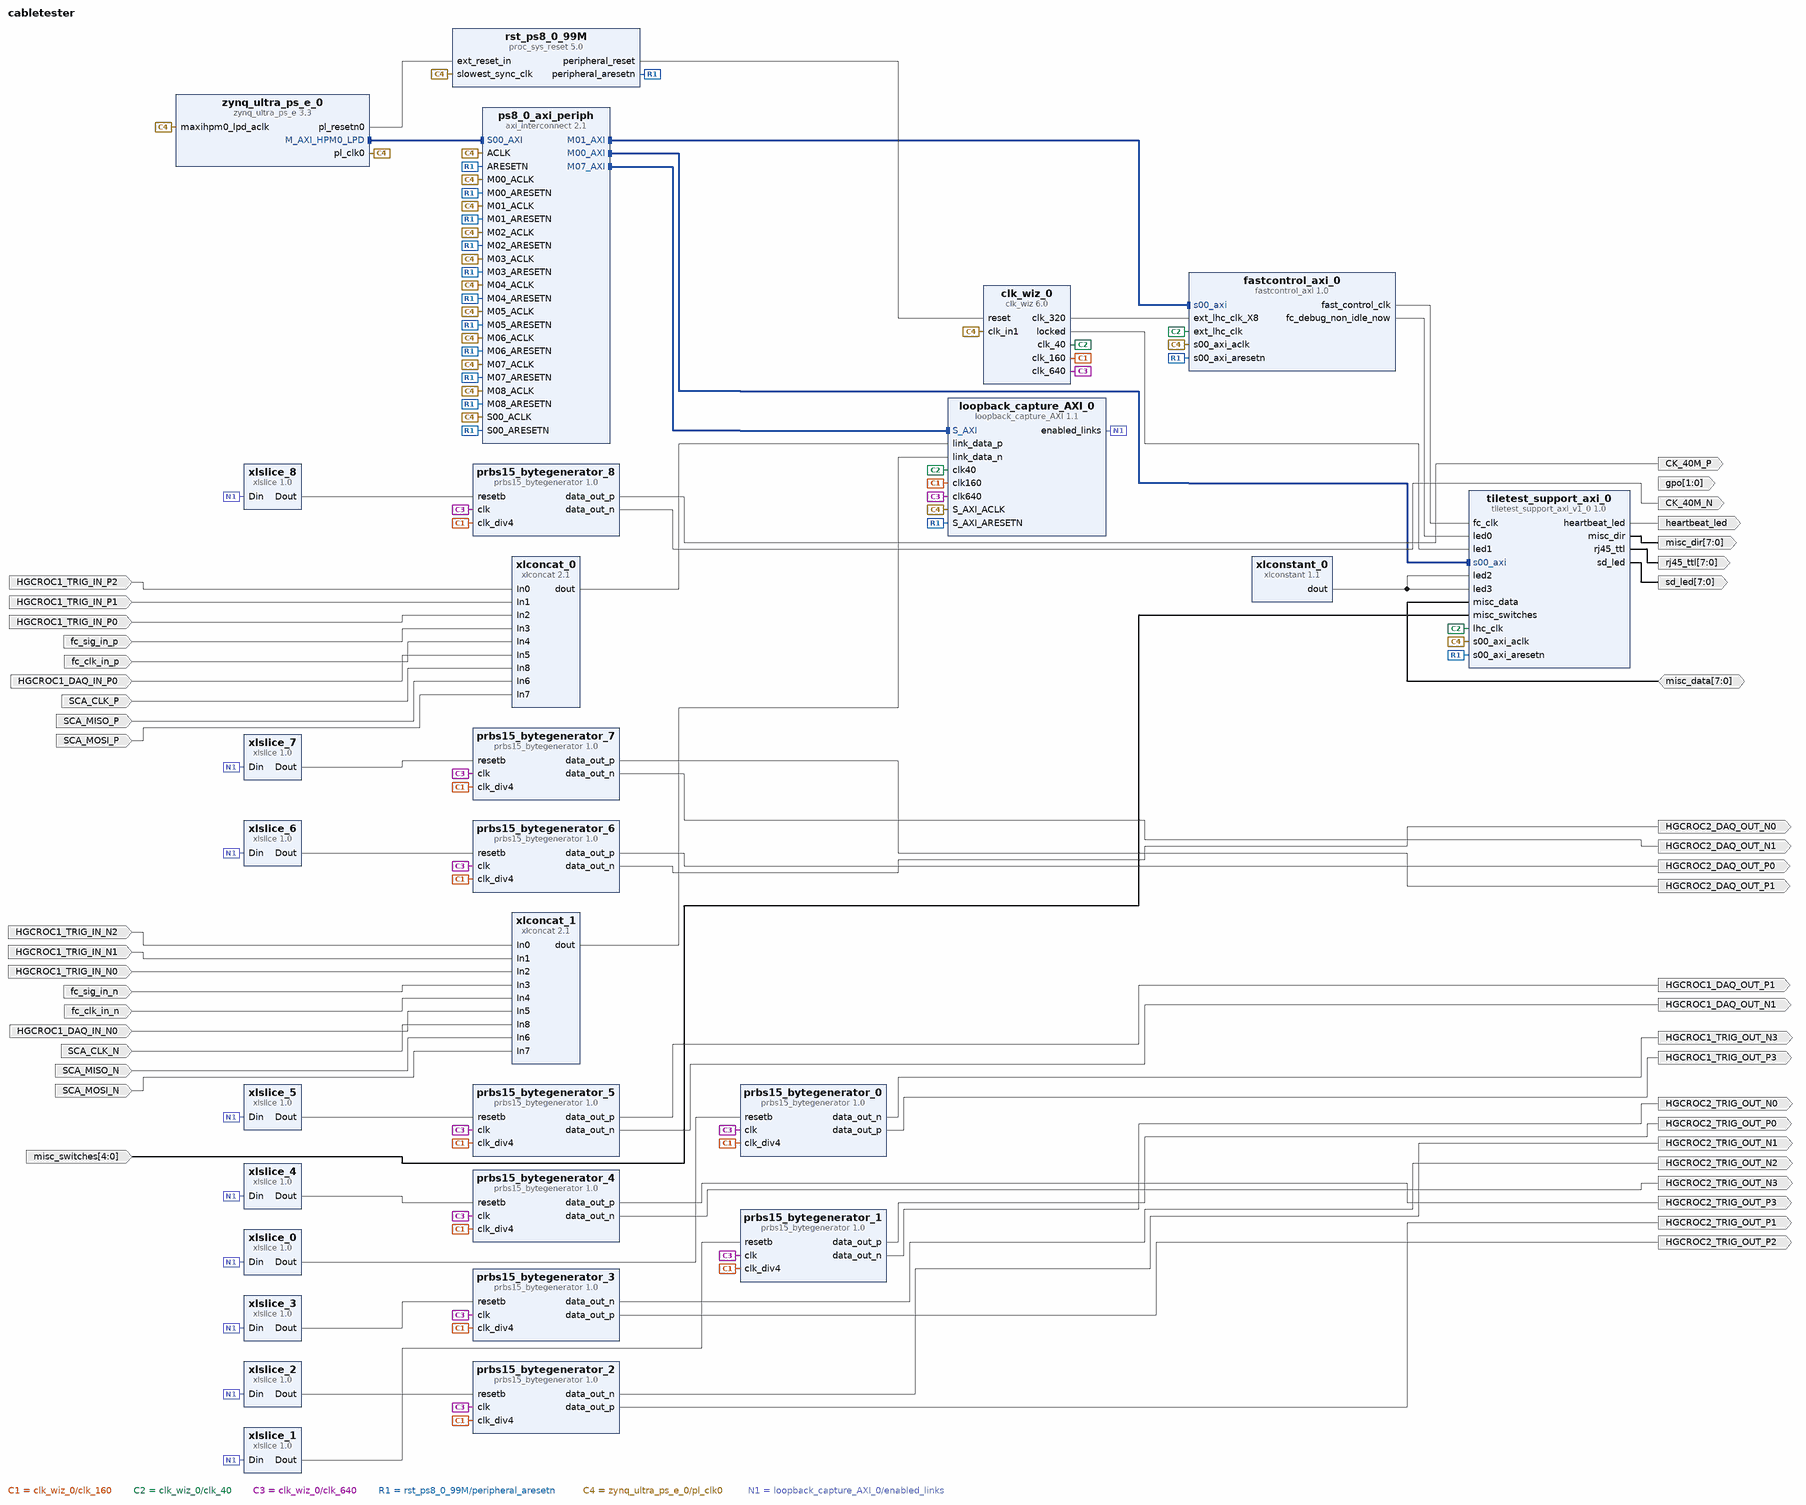
[diagram p0: block diagram of the top level]
# Vivado block design cabletester, xczu2cg-sfvc784-1-e, Vivado 2019.2
create_bd_design cabletester

create_bd_port -dir I HGCROC1_TRIG_IN_N2
create_bd_port -dir I HGCROC1_TRIG_IN_P2
create_bd_port -dir O HGCROC1_TRIG_OUT_N3
create_bd_port -dir O HGCROC1_TRIG_OUT_P3
create_bd_port -dir O -from 1 -to 0 gpo
create_bd_port -dir O heartbeat_led
create_bd_port -dir IO -from 7 -to 0 misc_data
create_bd_port -dir O -from 7 -to 0 misc_dir
create_bd_port -dir I -from 4 -to 0 misc_switches
create_bd_port -dir O -from 7 -to 0 rj45_ttl
create_bd_port -dir O -from 7 -to 0 sd_led
create_bd_port -dir O HGCROC2_TRIG_OUT_P1
create_bd_port -dir O HGCROC2_TRIG_OUT_P2
create_bd_port -dir O HGCROC2_TRIG_OUT_P3
create_bd_port -dir O HGCROC2_TRIG_OUT_P0
create_bd_port -dir O HGCROC2_TRIG_OUT_N2
create_bd_port -dir O HGCROC2_TRIG_OUT_N3
create_bd_port -dir O HGCROC2_TRIG_OUT_N0
create_bd_port -dir O HGCROC2_TRIG_OUT_N1
create_bd_port -dir O HGCROC1_DAQ_OUT_P1
create_bd_port -dir O HGCROC1_DAQ_OUT_N1
create_bd_port -dir O HGCROC2_DAQ_OUT_P0
create_bd_port -dir O HGCROC2_DAQ_OUT_P1
create_bd_port -dir O HGCROC2_DAQ_OUT_N0
create_bd_port -dir O HGCROC2_DAQ_OUT_N1
create_bd_port -dir O CK_40M_P
create_bd_port -dir O CK_40M_N
create_bd_port -dir I HGCROC1_TRIG_IN_P1
create_bd_port -dir I HGCROC1_TRIG_IN_N1
create_bd_port -dir I HGCROC1_TRIG_IN_P0
create_bd_port -dir I HGCROC1_TRIG_IN_N0
create_bd_port -dir I fc_sig_in_p
create_bd_port -dir I fc_sig_in_n
create_bd_port -dir I fc_clk_in_p
create_bd_port -dir I fc_clk_in_n
create_bd_port -dir I HGCROC1_DAQ_IN_P0
create_bd_port -dir I HGCROC1_DAQ_IN_N0
create_bd_port -dir I SCA_MOSI_P
create_bd_port -dir I SCA_MOSI_N
create_bd_port -dir I SCA_MISO_P
create_bd_port -dir I SCA_MISO_N
create_bd_port -dir I SCA_CLK_P
create_bd_port -dir I SCA_CLK_N

create_bd_cell -type ip -vlnv xilinx.com:user:fastcontrol_axi:1.0 fastcontrol_axi_0
create_bd_cell -type ip -vlnv xilinx.com:ip:proc_sys_reset:5.0 rst_ps8_0_99M
create_bd_cell -type ip -vlnv xilinx.com:user:tiletest_support_axi_v1_0:1.0 tiletest_support_axi_0
create_bd_cell -type ip -vlnv user.org:user:prbs15_bytegenerator:1.0 prbs15_bytegenerator_0
create_bd_cell -type ip -vlnv user.org:user:prbs15_bytegenerator:1.0 prbs15_bytegenerator_1
create_bd_cell -type ip -vlnv user.org:user:prbs15_bytegenerator:1.0 prbs15_bytegenerator_2
create_bd_cell -type ip -vlnv user.org:user:prbs15_bytegenerator:1.0 prbs15_bytegenerator_3
create_bd_cell -type ip -vlnv user.org:user:prbs15_bytegenerator:1.0 prbs15_bytegenerator_4
create_bd_cell -type ip -vlnv user.org:user:prbs15_bytegenerator:1.0 prbs15_bytegenerator_5
create_bd_cell -type ip -vlnv user.org:user:prbs15_bytegenerator:1.0 prbs15_bytegenerator_6
create_bd_cell -type ip -vlnv user.org:user:prbs15_bytegenerator:1.0 prbs15_bytegenerator_7
create_bd_cell -type ip -vlnv user.org:user:prbs15_bytegenerator:1.0 prbs15_bytegenerator_8
create_bd_cell -type ip -vlnv user.org:user:loopback_capture_AXI:1.1 loopback_capture_AXI_0
create_bd_cell -type ip -vlnv xilinx.com:ip:clk_wiz:6.0 clk_wiz_0
set_property -dict [list \
  CONFIG.CLKOUT1_JITTER 161.073 \
  CONFIG.CLKOUT1_PHASE_ERROR 320.727 \
  CONFIG.CLKOUT1_REQUESTED_OUT_FREQ 320 \
  CONFIG.CLKOUT2_JITTER 212.577 \
  CONFIG.CLKOUT2_PHASE_ERROR 320.727 \
  CONFIG.CLKOUT2_REQUESTED_OUT_FREQ 40 \
  CONFIG.CLKOUT2_USED true \
  CONFIG.CLKOUT3_JITTER 193.445 \
  CONFIG.CLKOUT3_PHASE_ERROR 320.727 \
  CONFIG.CLKOUT3_REQUESTED_OUT_FREQ 80 \
  CONFIG.CLKOUT3_USED true \
  CONFIG.CLKOUT4_JITTER 176.430 \
  CONFIG.CLKOUT4_PHASE_ERROR 320.727 \
  CONFIG.CLKOUT4_REQUESTED_OUT_FREQ 160 \
  CONFIG.CLKOUT4_USED true \
  CONFIG.CLKOUT5_JITTER 147.227 \
  CONFIG.CLKOUT5_PHASE_ERROR 320.727 \
  CONFIG.CLKOUT5_REQUESTED_OUT_FREQ 640 \
  CONFIG.CLKOUT5_USED true \
  CONFIG.CLK_OUT1_PORT clk_320 \
  CONFIG.CLK_OUT2_PORT clk_40 \
  CONFIG.CLK_OUT3_PORT clk_80 \
  CONFIG.CLK_OUT4_PORT clk_160 \
  CONFIG.CLK_OUT5_PORT clk_640 \
  CONFIG.MMCM_CLKFBOUT_MULT_F 64.000 \
  CONFIG.MMCM_CLKIN1_PERIOD 10.000 \
  CONFIG.MMCM_CLKIN2_PERIOD 10.000 \
  CONFIG.MMCM_CLKOUT0_DIVIDE_F 4.000 \
  CONFIG.MMCM_CLKOUT1_DIVIDE 32 \
  CONFIG.MMCM_CLKOUT2_DIVIDE 16 \
  CONFIG.MMCM_CLKOUT3_DIVIDE 8 \
  CONFIG.MMCM_CLKOUT4_DIVIDE 2 \
  CONFIG.MMCM_DIVCLK_DIVIDE 5 \
  CONFIG.NUM_OUT_CLKS 5 \
] [get_bd_cells clk_wiz_0]
create_bd_cell -type ip -vlnv xilinx.com:ip:axi_interconnect:2.1 ps8_0_axi_periph
set_property -dict {CONFIG.NUM_MI 9} [get_bd_cells ps8_0_axi_periph]
create_bd_cell -type ip -vlnv xilinx.com:ip:xlconcat:2.1 xlconcat_0
set_property -dict {CONFIG.NUM_PORTS 9 CONFIG.dout_width 9} [get_bd_cells xlconcat_0]
create_bd_cell -type ip -vlnv xilinx.com:ip:xlconcat:2.1 xlconcat_1
set_property -dict {CONFIG.NUM_PORTS 9 CONFIG.dout_width 9} [get_bd_cells xlconcat_1]
create_bd_cell -type ip -vlnv xilinx.com:ip:xlconstant:1.1 xlconstant_0
set_property -dict {CONFIG.CONST_VAL 0} [get_bd_cells xlconstant_0]
create_bd_cell -type ip -vlnv xilinx.com:ip:xlslice:1.0 xlslice_0
set_property -dict {CONFIG.DIN_FROM 0 CONFIG.DIN_TO 0 CONFIG.DIN_WIDTH 9 CONFIG.DOUT_WIDTH 1} [get_bd_cells xlslice_0]
create_bd_cell -type ip -vlnv xilinx.com:ip:xlslice:1.0 xlslice_1
set_property -dict {CONFIG.DIN_FROM 1 CONFIG.DIN_TO 1 CONFIG.DIN_WIDTH 9 CONFIG.DOUT_WIDTH 1} [get_bd_cells xlslice_1]
create_bd_cell -type ip -vlnv xilinx.com:ip:xlslice:1.0 xlslice_2
set_property -dict {CONFIG.DIN_FROM 2 CONFIG.DIN_TO 2 CONFIG.DIN_WIDTH 9 CONFIG.DOUT_WIDTH 1} [get_bd_cells xlslice_2]
create_bd_cell -type ip -vlnv xilinx.com:ip:xlslice:1.0 xlslice_3
set_property -dict {CONFIG.DIN_FROM 3 CONFIG.DIN_TO 3 CONFIG.DIN_WIDTH 9 CONFIG.DOUT_WIDTH 1} [get_bd_cells xlslice_3]
create_bd_cell -type ip -vlnv xilinx.com:ip:xlslice:1.0 xlslice_4
set_property -dict {CONFIG.DIN_FROM 4 CONFIG.DIN_TO 4 CONFIG.DIN_WIDTH 9 CONFIG.DOUT_WIDTH 1} [get_bd_cells xlslice_4]
create_bd_cell -type ip -vlnv xilinx.com:ip:xlslice:1.0 xlslice_5
set_property -dict {CONFIG.DIN_FROM 5 CONFIG.DIN_TO 5 CONFIG.DIN_WIDTH 9 CONFIG.DOUT_WIDTH 1} [get_bd_cells xlslice_5]
create_bd_cell -type ip -vlnv xilinx.com:ip:xlslice:1.0 xlslice_6
set_property -dict {CONFIG.DIN_FROM 6 CONFIG.DIN_TO 6 CONFIG.DIN_WIDTH 9 CONFIG.DOUT_WIDTH 1} [get_bd_cells xlslice_6]
create_bd_cell -type ip -vlnv xilinx.com:ip:xlslice:1.0 xlslice_7
set_property -dict {CONFIG.DIN_FROM 7 CONFIG.DIN_TO 7 CONFIG.DIN_WIDTH 9 CONFIG.DOUT_WIDTH 1} [get_bd_cells xlslice_7]
create_bd_cell -type ip -vlnv xilinx.com:ip:xlslice:1.0 xlslice_8
set_property -dict {CONFIG.DIN_FROM 8 CONFIG.DIN_TO 8 CONFIG.DIN_WIDTH 9 CONFIG.DOUT_WIDTH 1} [get_bd_cells xlslice_8]
create_bd_cell -type ip -vlnv xilinx.com:ip:zynq_ultra_ps_e:3.3 zynq_ultra_ps_e_0
set_property -dict [list \
  CONFIG.CAN0_BOARD_INTERFACE custom \
  CONFIG.CAN1_BOARD_INTERFACE custom \
  CONFIG.CSU_BOARD_INTERFACE custom \
  CONFIG.DP_BOARD_INTERFACE custom \
  CONFIG.GEM0_BOARD_INTERFACE custom \
  CONFIG.GEM1_BOARD_INTERFACE custom \
  CONFIG.GEM2_BOARD_INTERFACE custom \
  CONFIG.GEM3_BOARD_INTERFACE custom \
  CONFIG.GPIO_BOARD_INTERFACE custom \
  CONFIG.IIC0_BOARD_INTERFACE custom \
  CONFIG.IIC1_BOARD_INTERFACE custom \
  CONFIG.NAND_BOARD_INTERFACE custom \
  CONFIG.PCIE_BOARD_INTERFACE custom \
  CONFIG.PJTAG_BOARD_INTERFACE custom \
  CONFIG.PMU_BOARD_INTERFACE custom \
  CONFIG.PSU_BANK_0_IO_STANDARD LVCMOS18 \
  CONFIG.PSU_BANK_1_IO_STANDARD LVCMOS33 \
  CONFIG.PSU_BANK_2_IO_STANDARD LVCMOS18 \
  CONFIG.PSU_BANK_3_IO_STANDARD LVCMOS18 \
  CONFIG.PSU_USB3__DUAL_CLOCK_ENABLE 1 \
  CONFIG.PSU__ACPU2__POWER__ON 0 \
  CONFIG.PSU__ACPU3__POWER__ON 0 \
  CONFIG.PSU__CAN1__PERIPHERAL__ENABLE 0 \
  CONFIG.PSU__CRF_APB__ACPU_CTRL__FREQMHZ 1200 \
  CONFIG.PSU__CRF_APB__ACPU_CTRL__SRCSEL APLL \
  CONFIG.PSU__CRF_APB__APLL_CTRL__SRCSEL PSS_REF_CLK \
  CONFIG.PSU__CRF_APB__DBG_FPD_CTRL__FREQMHZ 250 \
  CONFIG.PSU__CRF_APB__DBG_FPD_CTRL__SRCSEL IOPLL \
  CONFIG.PSU__CRF_APB__DBG_TRACE_CTRL__FREQMHZ 250 \
  CONFIG.PSU__CRF_APB__DBG_TRACE_CTRL__SRCSEL IOPLL \
  CONFIG.PSU__CRF_APB__DBG_TSTMP_CTRL__FREQMHZ 250 \
  CONFIG.PSU__CRF_APB__DBG_TSTMP_CTRL__SRCSEL IOPLL \
  CONFIG.PSU__CRF_APB__DDR_CTRL__FREQMHZ 1200 \
  CONFIG.PSU__CRF_APB__DDR_CTRL__SRCSEL DPLL \
  CONFIG.PSU__CRF_APB__DPDMA_REF_CTRL__FREQMHZ 600 \
  CONFIG.PSU__CRF_APB__DPDMA_REF_CTRL__SRCSEL DPLL \
  CONFIG.PSU__CRF_APB__DPLL_CTRL__SRCSEL PSS_REF_CLK \
  CONFIG.PSU__CRF_APB__DP_AUDIO_REF_CTRL__SRCSEL VPLL \
  CONFIG.PSU__CRF_APB__DP_STC_REF_CTRL__SRCSEL VPLL \
  CONFIG.PSU__CRF_APB__DP_VIDEO_REF_CTRL__SRCSEL DPLL \
  CONFIG.PSU__CRF_APB__GDMA_REF_CTRL__FREQMHZ 600 \
  CONFIG.PSU__CRF_APB__GDMA_REF_CTRL__SRCSEL DPLL \
  CONFIG.PSU__CRF_APB__GPU_REF_CTRL__FREQMHZ 600 \
  CONFIG.PSU__CRF_APB__GPU_REF_CTRL__SRCSEL DPLL \
  CONFIG.PSU__CRF_APB__TOPSW_LSBUS_CTRL__FREQMHZ 100 \
  CONFIG.PSU__CRF_APB__TOPSW_LSBUS_CTRL__SRCSEL IOPLL \
  CONFIG.PSU__CRF_APB__TOPSW_MAIN_CTRL__FREQMHZ 533.333 \
  CONFIG.PSU__CRF_APB__TOPSW_MAIN_CTRL__SRCSEL VPLL \
  CONFIG.PSU__CRF_APB__VPLL_CTRL__SRCSEL PSS_REF_CLK \
  CONFIG.PSU__CRL_APB__ADMA_REF_CTRL__FREQMHZ 500 \
  CONFIG.PSU__CRL_APB__ADMA_REF_CTRL__SRCSEL IOPLL \
  CONFIG.PSU__CRL_APB__CAN1_REF_CTRL__FREQMHZ 100 \
  CONFIG.PSU__CRL_APB__CAN1_REF_CTRL__SRCSEL IOPLL \
  CONFIG.PSU__CRL_APB__CPU_R5_CTRL__FREQMHZ 500 \
  CONFIG.PSU__CRL_APB__CPU_R5_CTRL__SRCSEL IOPLL \
  CONFIG.PSU__CRL_APB__DBG_LPD_CTRL__FREQMHZ 250 \
  CONFIG.PSU__CRL_APB__DBG_LPD_CTRL__SRCSEL IOPLL \
  CONFIG.PSU__CRL_APB__GEM3_REF_CTRL__FREQMHZ 125 \
  CONFIG.PSU__CRL_APB__GEM3_REF_CTRL__SRCSEL IOPLL \
  CONFIG.PSU__CRL_APB__I2C0_REF_CTRL__FREQMHZ 100 \
  CONFIG.PSU__CRL_APB__I2C0_REF_CTRL__SRCSEL IOPLL \
  CONFIG.PSU__CRL_APB__I2C1_REF_CTRL__FREQMHZ 100 \
  CONFIG.PSU__CRL_APB__I2C1_REF_CTRL__SRCSEL IOPLL \
  CONFIG.PSU__CRL_APB__IOPLL_CTRL__SRCSEL PSS_REF_CLK \
  CONFIG.PSU__CRL_APB__IOU_SWITCH_CTRL__FREQMHZ 267 \
  CONFIG.PSU__CRL_APB__IOU_SWITCH_CTRL__SRCSEL RPLL \
  CONFIG.PSU__CRL_APB__LPD_LSBUS_CTRL__FREQMHZ 100 \
  CONFIG.PSU__CRL_APB__LPD_LSBUS_CTRL__SRCSEL IOPLL \
  CONFIG.PSU__CRL_APB__LPD_SWITCH_CTRL__FREQMHZ 500 \
  CONFIG.PSU__CRL_APB__LPD_SWITCH_CTRL__SRCSEL IOPLL \
  CONFIG.PSU__CRL_APB__PCAP_CTRL__FREQMHZ 200 \
  CONFIG.PSU__CRL_APB__PCAP_CTRL__SRCSEL IOPLL \
  CONFIG.PSU__CRL_APB__PL0_REF_CTRL__FREQMHZ 100 \
  CONFIG.PSU__CRL_APB__PL0_REF_CTRL__SRCSEL RPLL \
  CONFIG.PSU__CRL_APB__QSPI_REF_CTRL__FREQMHZ 300 \
  CONFIG.PSU__CRL_APB__QSPI_REF_CTRL__SRCSEL IOPLL \
  CONFIG.PSU__CRL_APB__RPLL_CTRL__SRCSEL PSS_REF_CLK \
  CONFIG.PSU__CRL_APB__SDIO1_REF_CTRL__FREQMHZ 200 \
  CONFIG.PSU__CRL_APB__SDIO1_REF_CTRL__SRCSEL RPLL \
  CONFIG.PSU__CRL_APB__TIMESTAMP_REF_CTRL__FREQMHZ 100 \
  CONFIG.PSU__CRL_APB__TIMESTAMP_REF_CTRL__SRCSEL PSS_REF_CLK \
  CONFIG.PSU__CRL_APB__UART0_REF_CTRL__FREQMHZ 100 \
  CONFIG.PSU__CRL_APB__UART0_REF_CTRL__SRCSEL IOPLL \
  CONFIG.PSU__CRL_APB__UART1_REF_CTRL__FREQMHZ 100 \
  CONFIG.PSU__CRL_APB__UART1_REF_CTRL__SRCSEL IOPLL \
  CONFIG.PSU__CRL_APB__USB0_BUS_REF_CTRL__FREQMHZ 250 \
  CONFIG.PSU__CRL_APB__USB0_BUS_REF_CTRL__SRCSEL IOPLL \
  CONFIG.PSU__CRL_APB__USB3_DUAL_REF_CTRL__FREQMHZ 20 \
  CONFIG.PSU__CRL_APB__USB3_DUAL_REF_CTRL__SRCSEL IOPLL \
  CONFIG.PSU__CRL_APB__USB3__ENABLE 1 \
  CONFIG.PSU__CSUPMU__PERIPHERAL__VALID 0 \
  CONFIG.PSU__DDRC__BUS_WIDTH {32 Bit} \
  CONFIG.PSU__DDRC__COMPONENTS Components \
  CONFIG.PSU__DDRC__DEVICE_CAPACITY {8192 MBits} \
  CONFIG.PSU__DDRC__DRAM_WIDTH {16 Bits} \
  CONFIG.PSU__DDRC__ECC Disabled \
  CONFIG.PSU__DDRC__MEMORY_TYPE {DDR 4} \
  CONFIG.PSU__DDRC__SPEED_BIN DDR4_2400P \
  CONFIG.PSU__DDR_HIGH_ADDRESS_GUI_ENABLE 0 \
  CONFIG.PSU__DDR__INTERFACE__FREQMHZ 600.000 \
  CONFIG.PSU__DEVICE_TYPE CG \
  CONFIG.PSU__DISPLAYPORT__PERIPHERAL__ENABLE 0 \
  CONFIG.PSU__DLL__ISUSED 1 \
  CONFIG.PSU__ENET3__FIFO__ENABLE 0 \
  CONFIG.PSU__ENET3__GRP_MDIO__ENABLE 1 \
  CONFIG.PSU__ENET3__GRP_MDIO__IO {MIO 76 .. 77} \
  CONFIG.PSU__ENET3__PERIPHERAL__ENABLE 1 \
  CONFIG.PSU__ENET3__PERIPHERAL__IO {MIO 64 .. 75} \
  CONFIG.PSU__ENET3__PTP__ENABLE 0 \
  CONFIG.PSU__ENET3__TSU__ENABLE 0 \
  CONFIG.PSU__FPGA_PL0_ENABLE 1 \
  CONFIG.PSU__GEM3_COHERENCY 0 \
  CONFIG.PSU__GEM3_ROUTE_THROUGH_FPD 0 \
  CONFIG.PSU__GEM__TSU__ENABLE 0 \
  CONFIG.PSU__GPIO0_MIO__IO {MIO 0 .. 25} \
  CONFIG.PSU__GPIO0_MIO__PERIPHERAL__ENABLE 1 \
  CONFIG.PSU__GPIO1_MIO__PERIPHERAL__ENABLE 0 \
  CONFIG.PSU__GPU_PP0__POWER__ON 0 \
  CONFIG.PSU__GPU_PP1__POWER__ON 0 \
  CONFIG.PSU__I2C0__PERIPHERAL__ENABLE 1 \
  CONFIG.PSU__I2C0__PERIPHERAL__IO {MIO 38 .. 39} \
  CONFIG.PSU__I2C1__PERIPHERAL__ENABLE 0 \
  CONFIG.PSU__IOU_SLCR__IOU_TTC_APB_CLK__TTC0_SEL APB \
  CONFIG.PSU__IOU_SLCR__IOU_TTC_APB_CLK__TTC1_SEL APB \
  CONFIG.PSU__IOU_SLCR__IOU_TTC_APB_CLK__TTC2_SEL APB \
  CONFIG.PSU__IOU_SLCR__IOU_TTC_APB_CLK__TTC3_SEL APB \
  CONFIG.PSU__LPD_SLCR__CSUPMU__FREQMHZ 100 \
  CONFIG.PSU__OVERRIDE__BASIC_CLOCK 0 \
  CONFIG.PSU__PMU__PERIPHERAL__ENABLE 0 \
  CONFIG.PSU__PRESET_APPLIED 1 \
  CONFIG.PSU__PSS_REF_CLK__FREQMHZ 33.33333 \
  CONFIG.PSU__QSPI_COHERENCY 0 \
  CONFIG.PSU__QSPI_ROUTE_THROUGH_FPD 0 \
  CONFIG.PSU__QSPI__GRP_FBCLK__ENABLE 1 \
  CONFIG.PSU__QSPI__GRP_FBCLK__IO {MIO 6} \
  CONFIG.PSU__QSPI__PERIPHERAL__DATA_MODE x4 \
  CONFIG.PSU__QSPI__PERIPHERAL__ENABLE 1 \
  CONFIG.PSU__QSPI__PERIPHERAL__IO {MIO 0 .. 12} \
  CONFIG.PSU__QSPI__PERIPHERAL__MODE {Dual Parallel} \
  CONFIG.PSU__SATA__PERIPHERAL__ENABLE 0 \
  CONFIG.PSU__SD0__DATA_TRANSFER_MODE 8Bit \
  CONFIG.PSU__SD0__GRP_POW__ENABLE 1 \
  CONFIG.PSU__SD0__GRP_POW__IO {MIO 23} \
  CONFIG.PSU__SD0__PERIPHERAL__ENABLE 1 \
  CONFIG.PSU__SD0__PERIPHERAL__IO {MIO 13 .. 22} \
  CONFIG.PSU__SD0__RESET__ENABLE 1 \
  CONFIG.PSU__SD0__SLOT_TYPE eMMC \
  CONFIG.PSU__SD1_COHERENCY 0 \
  CONFIG.PSU__SD1_ROUTE_THROUGH_FPD 0 \
  CONFIG.PSU__SD1__DATA_TRANSFER_MODE 4Bit \
  CONFIG.PSU__SD1__GRP_CD__ENABLE 0 \
  CONFIG.PSU__SD1__GRP_POW__ENABLE 0 \
  CONFIG.PSU__SD1__GRP_WP__ENABLE 0 \
  CONFIG.PSU__SD1__PERIPHERAL__ENABLE 1 \
  CONFIG.PSU__SD1__PERIPHERAL__IO {MIO 46 .. 51} \
  CONFIG.PSU__SD1__SLOT_TYPE {SD 2.0} \
  CONFIG.PSU__SWDT0__CLOCK__ENABLE 0 \
  CONFIG.PSU__SWDT0__PERIPHERAL__ENABLE 1 \
  CONFIG.PSU__SWDT0__RESET__ENABLE 0 \
  CONFIG.PSU__SWDT1__CLOCK__ENABLE 0 \
  CONFIG.PSU__SWDT1__PERIPHERAL__ENABLE 1 \
  CONFIG.PSU__SWDT1__RESET__ENABLE 0 \
  CONFIG.PSU__TSU__BUFG_PORT_PAIR 0 \
  CONFIG.PSU__TTC0__CLOCK__ENABLE 0 \
  CONFIG.PSU__TTC0__PERIPHERAL__ENABLE 1 \
  CONFIG.PSU__TTC0__WAVEOUT__ENABLE 0 \
  CONFIG.PSU__TTC1__CLOCK__ENABLE 0 \
  CONFIG.PSU__TTC1__PERIPHERAL__ENABLE 1 \
  CONFIG.PSU__TTC1__WAVEOUT__ENABLE 0 \
  CONFIG.PSU__TTC2__CLOCK__ENABLE 0 \
  CONFIG.PSU__TTC2__PERIPHERAL__ENABLE 1 \
  CONFIG.PSU__TTC2__WAVEOUT__ENABLE 0 \
  CONFIG.PSU__TTC3__CLOCK__ENABLE 0 \
  CONFIG.PSU__TTC3__PERIPHERAL__ENABLE 1 \
  CONFIG.PSU__TTC3__WAVEOUT__ENABLE 0 \
  CONFIG.PSU__UART0__BAUD_RATE 115200 \
  CONFIG.PSU__UART0__MODEM__ENABLE 0 \
  CONFIG.PSU__UART0__PERIPHERAL__ENABLE 1 \
  CONFIG.PSU__UART0__PERIPHERAL__IO {MIO 30 .. 31} \
  CONFIG.PSU__UART1__PERIPHERAL__ENABLE 0 \
  CONFIG.PSU__USB0_COHERENCY 0 \
  CONFIG.PSU__USB0__PERIPHERAL__ENABLE 1 \
  CONFIG.PSU__USB0__PERIPHERAL__IO {MIO 52 .. 63} \
  CONFIG.PSU__USB0__REF_CLK_FREQ 100 \
  CONFIG.PSU__USB0__REF_CLK_SEL {Ref Clk3} \
  CONFIG.PSU__USB2_0__EMIO__ENABLE 0 \
  CONFIG.PSU__USB3_0__EMIO__ENABLE 0 \
  CONFIG.PSU__USB3_0__PERIPHERAL__ENABLE 1 \
  CONFIG.PSU__USB3_0__PERIPHERAL__IO {GT Lane0} \
  CONFIG.PSU__USB__RESET__MODE {Boot Pin} \
  CONFIG.PSU__USB__RESET__POLARITY {Active Low} \
  CONFIG.PSU__USE__IRQ0 0 \
  CONFIG.PSU__USE__M_AXI_GP0 0 \
  CONFIG.PSU__USE__M_AXI_GP1 0 \
  CONFIG.PSU__USE__M_AXI_GP2 1 \
  CONFIG.QSPI_BOARD_INTERFACE custom \
  CONFIG.SATA_BOARD_INTERFACE custom \
  CONFIG.SD0_BOARD_INTERFACE custom \
  CONFIG.SD1_BOARD_INTERFACE custom \
  CONFIG.SPI0_BOARD_INTERFACE custom \
  CONFIG.SPI1_BOARD_INTERFACE custom \
  CONFIG.SUBPRESET1 Custom \
  CONFIG.SUBPRESET2 Custom \
  CONFIG.SWDT0_BOARD_INTERFACE custom \
  CONFIG.SWDT1_BOARD_INTERFACE custom \
  CONFIG.TRACE_BOARD_INTERFACE custom \
  CONFIG.TTC0_BOARD_INTERFACE custom \
  CONFIG.TTC1_BOARD_INTERFACE custom \
  CONFIG.TTC2_BOARD_INTERFACE custom \
  CONFIG.TTC3_BOARD_INTERFACE custom \
  CONFIG.UART0_BOARD_INTERFACE custom \
  CONFIG.UART1_BOARD_INTERFACE custom \
  CONFIG.USB0_BOARD_INTERFACE custom \
  CONFIG.USB1_BOARD_INTERFACE custom \
] [get_bd_cells zynq_ultra_ps_e_0]
# 726 more settings of zynq_ultra_ps_e_0 are not shown: defaults, MIO pin electricals, DDR timing, and values the tool derives

# ---- connections ----

connect_bd_intf_net [get_bd_intf_pins ps8_0_axi_periph/M00_AXI] [get_bd_intf_pins tiletest_support_axi_0/s00_axi]
connect_bd_intf_net [get_bd_intf_pins ps8_0_axi_periph/M07_AXI] [get_bd_intf_pins loopback_capture_AXI_0/S_AXI]
connect_bd_intf_net [get_bd_intf_pins ps8_0_axi_periph/M01_AXI] [get_bd_intf_pins fastcontrol_axi_0/s00_axi]
connect_bd_intf_net [get_bd_intf_pins zynq_ultra_ps_e_0/M_AXI_HPM0_LPD] [get_bd_intf_pins ps8_0_axi_periph/S00_AXI]
connect_bd_net [get_bd_ports misc_data] [get_bd_pins tiletest_support_axi_0/misc_data]
connect_bd_net [get_bd_pins clk_wiz_0/clk_160] \
  [get_bd_pins prbs15_bytegenerator_0/clk_div4] [get_bd_pins prbs15_bytegenerator_1/clk_div4] \
  [get_bd_pins prbs15_bytegenerator_2/clk_div4] [get_bd_pins prbs15_bytegenerator_3/clk_div4] \
  [get_bd_pins prbs15_bytegenerator_4/clk_div4] [get_bd_pins prbs15_bytegenerator_5/clk_div4] \
  [get_bd_pins prbs15_bytegenerator_6/clk_div4] [get_bd_pins prbs15_bytegenerator_7/clk_div4] \
  [get_bd_pins prbs15_bytegenerator_8/clk_div4] [get_bd_pins loopback_capture_AXI_0/clk160]
connect_bd_net [get_bd_pins clk_wiz_0/clk_320] [get_bd_pins fastcontrol_axi_0/ext_lhc_clk_X8]
connect_bd_net [get_bd_pins clk_wiz_0/clk_40] \
  [get_bd_pins fastcontrol_axi_0/ext_lhc_clk] [get_bd_pins tiletest_support_axi_0/lhc_clk] \
  [get_bd_pins loopback_capture_AXI_0/clk40]
connect_bd_net [get_bd_pins clk_wiz_0/clk_640] \
  [get_bd_pins prbs15_bytegenerator_0/clk] [get_bd_pins prbs15_bytegenerator_1/clk] [get_bd_pins prbs15_bytegenerator_2/clk] \
  [get_bd_pins prbs15_bytegenerator_3/clk] [get_bd_pins prbs15_bytegenerator_4/clk] [get_bd_pins prbs15_bytegenerator_5/clk] \
  [get_bd_pins prbs15_bytegenerator_6/clk] [get_bd_pins prbs15_bytegenerator_7/clk] [get_bd_pins prbs15_bytegenerator_8/clk] \
  [get_bd_pins loopback_capture_AXI_0/clk640]
connect_bd_net [get_bd_pins clk_wiz_0/locked] [get_bd_pins tiletest_support_axi_0/led1]
connect_bd_net [get_bd_pins fastcontrol_axi_0/fast_control_clk] [get_bd_pins tiletest_support_axi_0/fc_clk]
connect_bd_net [get_bd_pins fastcontrol_axi_0/fc_debug_non_idle_now] [get_bd_pins tiletest_support_axi_0/led0]
connect_bd_net [get_bd_ports misc_switches] [get_bd_pins tiletest_support_axi_0/misc_switches]
connect_bd_net [get_bd_pins prbs15_bytegenerator_0/data_out_n] [get_bd_ports HGCROC1_TRIG_OUT_N3]
connect_bd_net [get_bd_pins prbs15_bytegenerator_0/data_out_p] [get_bd_ports HGCROC1_TRIG_OUT_P3]
connect_bd_net [get_bd_pins rst_ps8_0_99M/peripheral_aresetn] \
  [get_bd_pins tiletest_support_axi_0/s00_axi_aresetn] [get_bd_pins fastcontrol_axi_0/s00_axi_aresetn] \
  [get_bd_pins loopback_capture_AXI_0/S_AXI_ARESETN] [get_bd_pins ps8_0_axi_periph/ARESETN] \
  [get_bd_pins ps8_0_axi_periph/S00_ARESETN] [get_bd_pins ps8_0_axi_periph/M00_ARESETN] \
  [get_bd_pins ps8_0_axi_periph/M01_ARESETN] [get_bd_pins ps8_0_axi_periph/M02_ARESETN] \
  [get_bd_pins ps8_0_axi_periph/M03_ARESETN] [get_bd_pins ps8_0_axi_periph/M04_ARESETN] \
  [get_bd_pins ps8_0_axi_periph/M05_ARESETN] [get_bd_pins ps8_0_axi_periph/M06_ARESETN] \
  [get_bd_pins ps8_0_axi_periph/M07_ARESETN] [get_bd_pins ps8_0_axi_periph/M08_ARESETN]
connect_bd_net [get_bd_pins rst_ps8_0_99M/peripheral_reset] [get_bd_pins clk_wiz_0/reset]
connect_bd_net [get_bd_pins tiletest_support_axi_0/heartbeat_led] [get_bd_ports heartbeat_led]
connect_bd_net [get_bd_pins tiletest_support_axi_0/misc_dir] [get_bd_ports misc_dir]
connect_bd_net [get_bd_pins tiletest_support_axi_0/rj45_ttl] [get_bd_ports rj45_ttl]
connect_bd_net [get_bd_pins tiletest_support_axi_0/sd_led] [get_bd_ports sd_led]
connect_bd_net [get_bd_pins xlconstant_0/dout] [get_bd_pins tiletest_support_axi_0/led3] [get_bd_pins tiletest_support_axi_0/led2]
connect_bd_net [get_bd_pins zynq_ultra_ps_e_0/pl_clk0] \
  [get_bd_pins rst_ps8_0_99M/slowest_sync_clk] [get_bd_pins tiletest_support_axi_0/s00_axi_aclk] \
  [get_bd_pins fastcontrol_axi_0/s00_axi_aclk] [get_bd_pins loopback_capture_AXI_0/S_AXI_ACLK] \
  [get_bd_pins clk_wiz_0/clk_in1] [get_bd_pins ps8_0_axi_periph/ACLK] [get_bd_pins ps8_0_axi_periph/S00_ACLK] \
  [get_bd_pins ps8_0_axi_periph/M00_ACLK] [get_bd_pins ps8_0_axi_periph/M01_ACLK] [get_bd_pins ps8_0_axi_periph/M02_ACLK] \
  [get_bd_pins ps8_0_axi_periph/M03_ACLK] [get_bd_pins ps8_0_axi_periph/M04_ACLK] [get_bd_pins ps8_0_axi_periph/M05_ACLK] \
  [get_bd_pins ps8_0_axi_periph/M06_ACLK] [get_bd_pins ps8_0_axi_periph/M07_ACLK] [get_bd_pins ps8_0_axi_periph/M08_ACLK] \
  [get_bd_pins zynq_ultra_ps_e_0/maxihpm0_lpd_aclk]
connect_bd_net [get_bd_pins zynq_ultra_ps_e_0/pl_resetn0] [get_bd_pins rst_ps8_0_99M/ext_reset_in]
connect_bd_net [get_bd_pins xlconcat_0/dout] [get_bd_pins loopback_capture_AXI_0/link_data_p]
connect_bd_net [get_bd_pins xlconcat_1/dout] [get_bd_pins loopback_capture_AXI_0/link_data_n]
connect_bd_net -net HGCROC1_TRIG_IN_P2_1 [get_bd_ports HGCROC1_TRIG_IN_P2] [get_bd_pins xlconcat_0/In0]
connect_bd_net -net HGCROC1_TRIG_IN_N2_1 [get_bd_ports HGCROC1_TRIG_IN_N2] [get_bd_pins xlconcat_1/In0]
connect_bd_net [get_bd_pins prbs15_bytegenerator_5/data_out_p] [get_bd_ports HGCROC1_DAQ_OUT_P1]
connect_bd_net [get_bd_pins prbs15_bytegenerator_5/data_out_n] [get_bd_ports HGCROC1_DAQ_OUT_N1]
connect_bd_net [get_bd_pins prbs15_bytegenerator_6/data_out_p] [get_bd_ports HGCROC2_DAQ_OUT_P0]
connect_bd_net [get_bd_pins prbs15_bytegenerator_7/data_out_p] [get_bd_ports HGCROC2_DAQ_OUT_P1]
connect_bd_net [get_bd_pins prbs15_bytegenerator_6/data_out_n] [get_bd_ports HGCROC2_DAQ_OUT_N0]
connect_bd_net [get_bd_pins prbs15_bytegenerator_7/data_out_n] [get_bd_ports HGCROC2_DAQ_OUT_N1]
connect_bd_net [get_bd_pins prbs15_bytegenerator_8/data_out_p] [get_bd_ports CK_40M_P]
connect_bd_net [get_bd_pins prbs15_bytegenerator_8/data_out_n] [get_bd_ports CK_40M_N]
connect_bd_net -net HGCROC1_TRIG_IN_P1_1 [get_bd_ports HGCROC1_TRIG_IN_P1] [get_bd_pins xlconcat_0/In1]
connect_bd_net -net HGCROC1_TRIG_IN_N1_1 [get_bd_ports HGCROC1_TRIG_IN_N1] [get_bd_pins xlconcat_1/In1]
connect_bd_net -net HGCROC1_TRIG_IN_P0_1 [get_bd_ports HGCROC1_TRIG_IN_P0] [get_bd_pins xlconcat_0/In2]
connect_bd_net -net HGCROC1_TRIG_IN_N0_1 [get_bd_ports HGCROC1_TRIG_IN_N0] [get_bd_pins xlconcat_1/In2]
connect_bd_net [get_bd_ports fc_sig_in_p] [get_bd_pins xlconcat_0/In3]
connect_bd_net [get_bd_ports fc_sig_in_n] [get_bd_pins xlconcat_1/In3]
connect_bd_net [get_bd_ports fc_clk_in_p] [get_bd_pins xlconcat_0/In4]
connect_bd_net [get_bd_ports fc_clk_in_n] [get_bd_pins xlconcat_1/In4]
connect_bd_net -net HGCROC1_DAQ_IN_P0_1 [get_bd_ports HGCROC1_DAQ_IN_P0] [get_bd_pins xlconcat_0/In5]
connect_bd_net -net HGCROC1_DAQ_IN_N0_1 [get_bd_ports HGCROC1_DAQ_IN_N0] [get_bd_pins xlconcat_1/In5]
connect_bd_net [get_bd_ports SCA_CLK_P] [get_bd_pins xlconcat_0/In8]
connect_bd_net [get_bd_ports SCA_CLK_N] [get_bd_pins xlconcat_1/In8]
connect_bd_net [get_bd_pins loopback_capture_AXI_0/enabled_links] \
  [get_bd_pins xlslice_0/Din] [get_bd_pins xlslice_1/Din] [get_bd_pins xlslice_2/Din] [get_bd_pins xlslice_3/Din] \
  [get_bd_pins xlslice_4/Din] [get_bd_pins xlslice_5/Din] [get_bd_pins xlslice_6/Din] [get_bd_pins xlslice_7/Din] \
  [get_bd_pins xlslice_8/Din]
connect_bd_net [get_bd_pins xlslice_0/Dout] [get_bd_pins prbs15_bytegenerator_0/resetb]
connect_bd_net [get_bd_pins xlslice_1/Dout] [get_bd_pins prbs15_bytegenerator_1/resetb]
connect_bd_net [get_bd_pins xlslice_2/Dout] [get_bd_pins prbs15_bytegenerator_2/resetb]
connect_bd_net [get_bd_pins xlslice_3/Dout] [get_bd_pins prbs15_bytegenerator_3/resetb]
connect_bd_net [get_bd_pins xlslice_4/Dout] [get_bd_pins prbs15_bytegenerator_4/resetb]
connect_bd_net [get_bd_pins xlslice_5/Dout] [get_bd_pins prbs15_bytegenerator_5/resetb]
connect_bd_net [get_bd_pins xlslice_6/Dout] [get_bd_pins prbs15_bytegenerator_6/resetb]
connect_bd_net [get_bd_pins xlslice_7/Dout] [get_bd_pins prbs15_bytegenerator_7/resetb]
connect_bd_net [get_bd_pins xlslice_8/Dout] [get_bd_pins prbs15_bytegenerator_8/resetb]
connect_bd_net [get_bd_pins prbs15_bytegenerator_1/data_out_p] [get_bd_ports HGCROC2_TRIG_OUT_P0]
connect_bd_net [get_bd_pins prbs15_bytegenerator_1/data_out_n] [get_bd_ports HGCROC2_TRIG_OUT_N0]
connect_bd_net [get_bd_pins prbs15_bytegenerator_4/data_out_p] [get_bd_ports HGCROC2_TRIG_OUT_P3]
connect_bd_net [get_bd_pins prbs15_bytegenerator_4/data_out_n] [get_bd_ports HGCROC2_TRIG_OUT_N3]
connect_bd_net [get_bd_pins prbs15_bytegenerator_3/data_out_n] [get_bd_ports HGCROC2_TRIG_OUT_N2]
connect_bd_net [get_bd_pins prbs15_bytegenerator_3/data_out_p] [get_bd_ports HGCROC2_TRIG_OUT_P2]
connect_bd_net [get_bd_pins prbs15_bytegenerator_2/data_out_n] [get_bd_ports HGCROC2_TRIG_OUT_N1]
connect_bd_net [get_bd_pins prbs15_bytegenerator_2/data_out_p] [get_bd_ports HGCROC2_TRIG_OUT_P1]
connect_bd_net [get_bd_ports SCA_MISO_P] [get_bd_pins xlconcat_0/In6]
connect_bd_net [get_bd_ports SCA_MISO_N] [get_bd_pins xlconcat_1/In6]
connect_bd_net [get_bd_ports SCA_MOSI_P] [get_bd_pins xlconcat_0/In7]
connect_bd_net [get_bd_ports SCA_MOSI_N] [get_bd_pins xlconcat_1/In7]

# ---- address map ----
assign_bd_address -offset 0x0080001000 -range 4K -target_address_space [get_bd_addr_spaces zynq_ultra_ps_e_0/Data] [get_bd_addr_segs fastcontrol_axi_0/s00_axi/reg0]
assign_bd_address -offset 0x0080002000 -range 4K -target_address_space [get_bd_addr_spaces zynq_ultra_ps_e_0/Data] [get_bd_addr_segs tiletest_support_axi_0/s00_axi/reg0]
assign_bd_address -offset 0x0080004000 -range 4K -target_address_space [get_bd_addr_spaces zynq_ultra_ps_e_0/Data] [get_bd_addr_segs loopback_capture_AXI_0/S_AXI/reg0]

validate_bd_design
save_bd_design
